# Altium schematic sheet Arria10_Power.SchDoc: Arria 10 Power Inputs
size B; DocumentNumber: 30; SheetNumber: 30; SheetTotal: 46
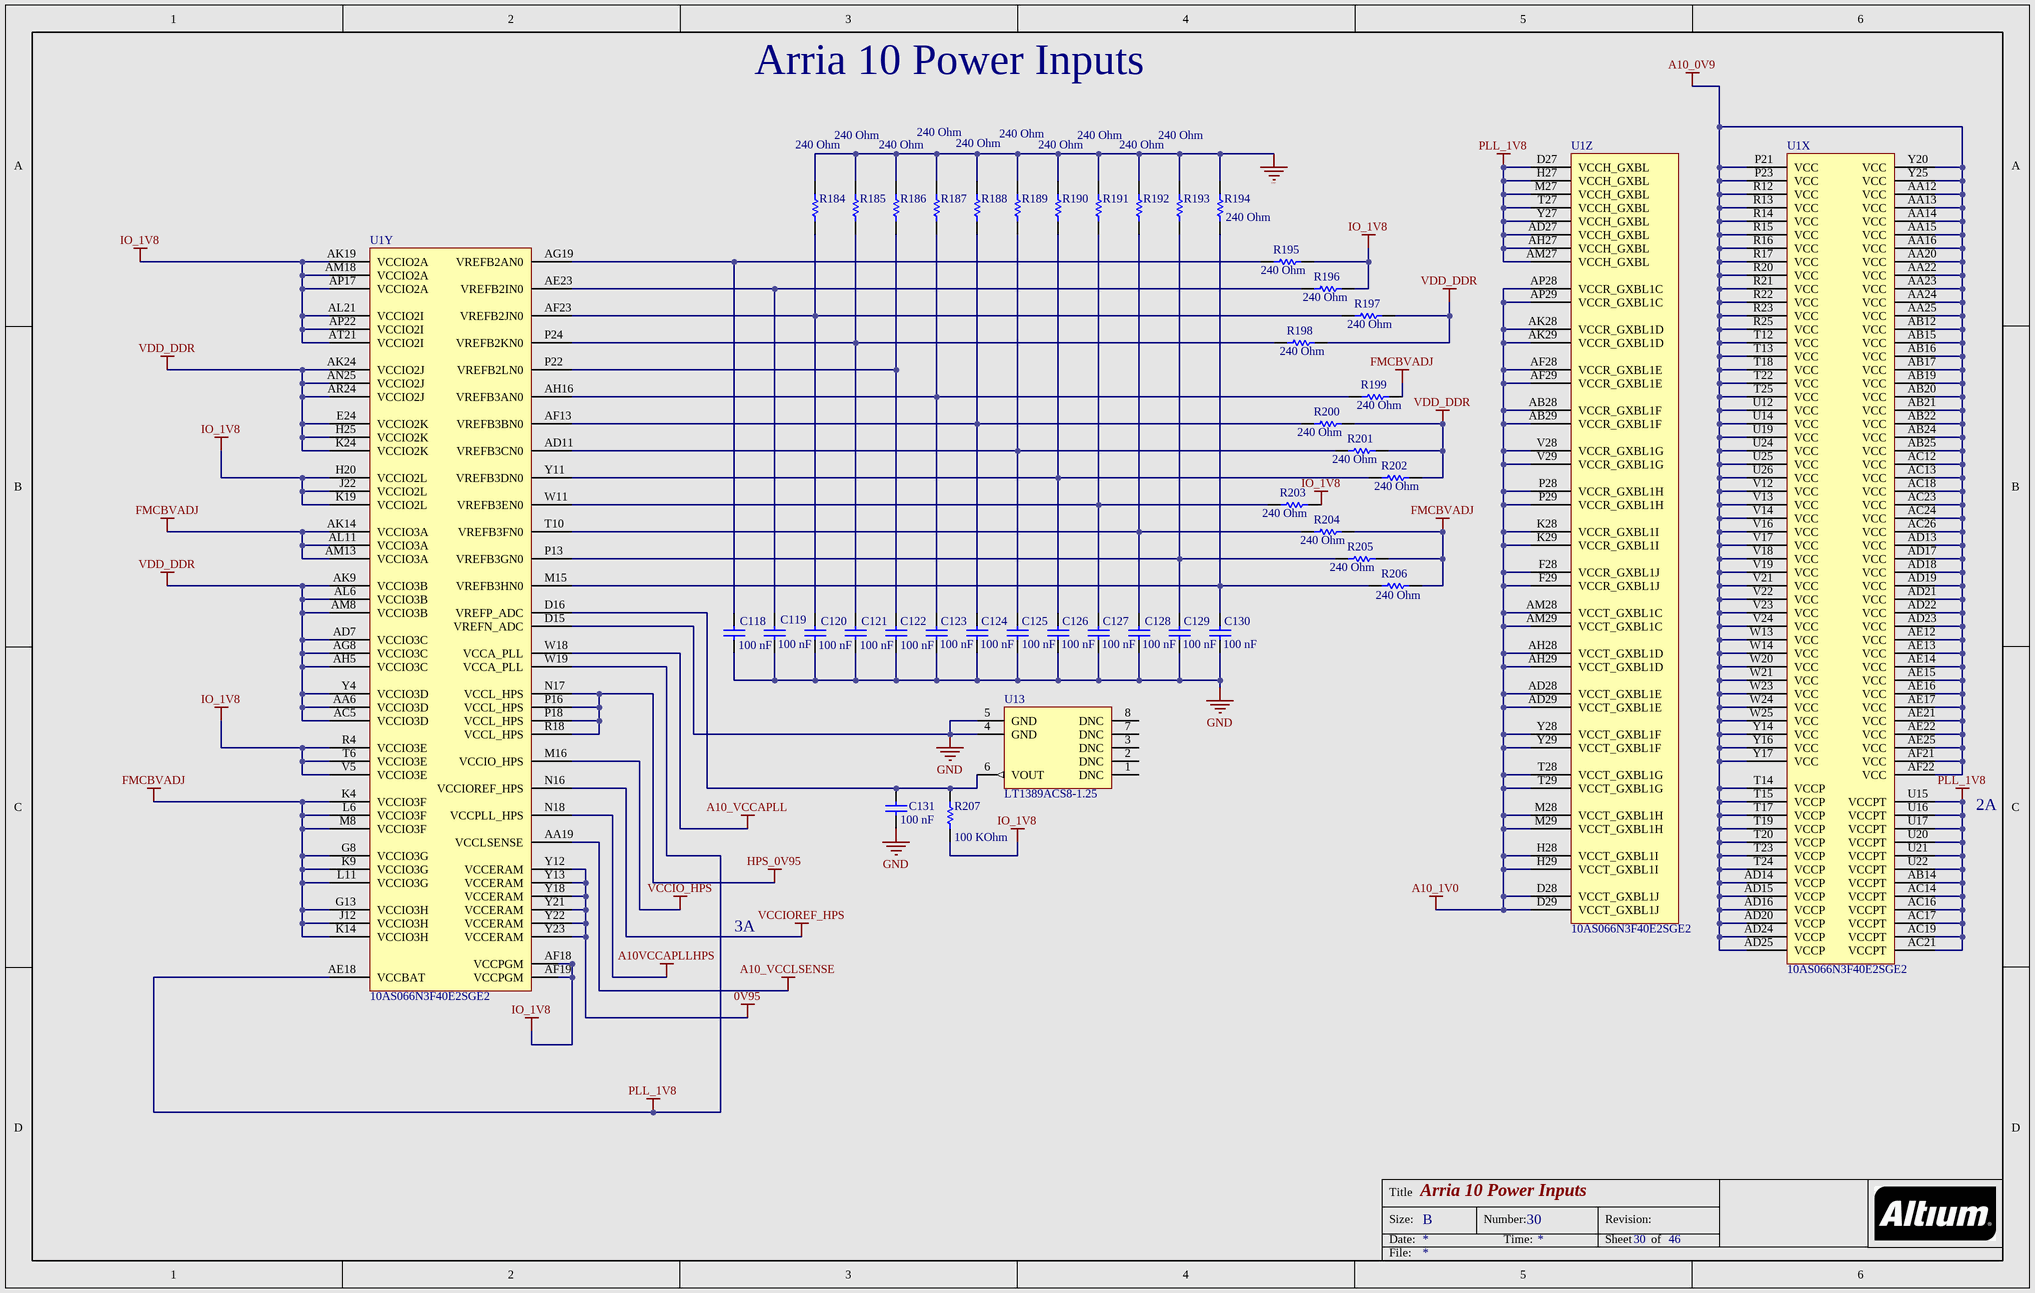
[diagram p0: Arria10_Power.SchDoc]

## Parts
C118  Capacitance: 100 nF  [CAPC0603X33X15LL03T05]  (hidden comment: GRM033R60J104KE19D)
C119  Capacitance: 100 nF  [CAPC0603X33X15LL03T05]  (hidden comment: GRM033R60J104KE19D)
C120  Capacitance: 100 nF  [CAPC0603X33X15LL03T05]  (hidden comment: GRM033R60J104KE19D)
C121  Capacitance: 100 nF  [CAPC0603X33X15LL03T05]  (hidden comment: GRM033R60J104KE19D)
C122  Capacitance: 100 nF  [CAPC0603X33X15LL03T05]  (hidden comment: GRM033R60J104KE19D)
C123  Capacitance: 100 nF  [CAPC0603X33X15LL03T05]  (hidden comment: GRM033R60J104KE19D)
C124  Capacitance: 100 nF  [CAPC0603X33X15LL03T05]  (hidden comment: GRM033R60J104KE19D)
C125  Capacitance: 100 nF  [CAPC0603X33X15LL03T05]  (hidden comment: GRM033R60J104KE19D)
C126  Capacitance: 100 nF  [CAPC0603X33X15LL03T05]  (hidden comment: GRM033R60J104KE19D)
C127  Capacitance: 100 nF  [CAPC0603X33X15LL03T05]  (hidden comment: GRM033R60J104KE19D)
C128  Capacitance: 100 nF  [CAPC0603X33X15LL03T05]  (hidden comment: GRM033R60J104KE19D)
C129  Capacitance: 100 nF  [CAPC0603X33X15LL03T05]  (hidden comment: GRM033R60J104KE19D)
C130  Capacitance: 100 nF  [CAPC0603X33X15LL03T05]  (hidden comment: GRM033R60J104KE19D)
C131  Capacitance: 100 nF  [CAPC1005X55X10LL05]  (hidden comment: C1005X7R1E104M)
R184  Resistance: 240 Ohm  [RESC1005X40X25ML05T05]  (hidden comment: ERJ-2GEJ241x)
R185  Resistance: 240 Ohm  [RESC1005X40X25ML05T05]  (hidden comment: ERJ-2GEJ241x)
R186  Resistance: 240 Ohm  [RESC1005X40X25ML05T05]  (hidden comment: ERJ-2GEJ241x)
R187  Resistance: 240 Ohm  [RESC1005X40X25ML05T05]  (hidden comment: ERJ-2GEJ241x)
R188  Resistance: 240 Ohm  [RESC1005X40X25ML05T05]  (hidden comment: ERJ-2GEJ241x)
R189  Resistance: 240 Ohm  [RESC1005X40X25ML05T05]  (hidden comment: ERJ-2GEJ241x)
R190  Resistance: 240 Ohm  [RESC1005X40X25ML05T05]  (hidden comment: ERJ-2GEJ241x)
R191  Resistance: 240 Ohm  [RESC1005X40X25ML05T05]  (hidden comment: ERJ-2GEJ241x)
R192  Resistance: 240 Ohm  [RESC1005X40X25ML05T05]  (hidden comment: ERJ-2GEJ241x)
R193  Resistance: 240 Ohm  [RESC1005X40X25ML05T05]  (hidden comment: ERJ-2GEJ241x)
R194  Resistance: 240 Ohm  [RESC1005X40X25ML05T05]  (hidden comment: ERJ-2GEJ241x)
R195  Resistance: 240 Ohm  [RESC1005X40X25ML05T05]  (hidden comment: ERJ-2GEJ241x)
R196  Resistance: 240 Ohm  [RESC1005X40X25ML05T05]  (hidden comment: ERJ-2GEJ241x)
R197  Resistance: 240 Ohm  [RESC1005X40X25ML05T05]  (hidden comment: ERJ-2GEJ241x)
R198  Resistance: 240 Ohm  [RESC1005X40X25ML05T05]  (hidden comment: ERJ-2GEJ241x)
R199  Resistance: 240 Ohm  [RESC1005X40X25ML05T05]  (hidden comment: ERJ-2GEJ241x)
R200  Resistance: 240 Ohm  [RESC1005X40X25ML05T05]  (hidden comment: ERJ-2GEJ241x)
R201  Resistance: 240 Ohm  [RESC1005X40X25ML05T05]  (hidden comment: ERJ-2GEJ241x)
R202  Resistance: 240 Ohm  [RESC1005X40X25ML05T05]  (hidden comment: ERJ-2GEJ241x)
R203  Resistance: 240 Ohm  [RESC1005X40X25ML05T05]  (hidden comment: ERJ-2GEJ241x)
R204  Resistance: 240 Ohm  [RESC1005X40X25ML05T05]  (hidden comment: ERJ-2GEJ241x)
R205  Resistance: 240 Ohm  [RESC1005X40X25ML05T05]  (hidden comment: ERJ-2GEJ241x)
R206  Resistance: 240 Ohm  [RESC1005X40X25ML05T05]  (hidden comment: ERJ-2GEJ241x)
R207  Resistance: 100 KOhm  [RESC1005X40X25LL05T05]  (hidden comment: ERJ-2RKF1003X)
U1  10AS066N3F40E2SGE2  [ALTR-FBGA1517_A-350]  (parts X,Y,Z of 31)
U13  LT1389ACS8-1.25  [LT-S8-8_M]

## Nets
0V95: U1.Y12(VCCERAM) U1.Y13(VCCERAM) U1.Y18(VCCERAM) U1.Y21(VCCERAM) U1.Y22(VCCERAM) U1.Y23(VCCERAM)
A10_0V9: U1.AA12(VCC) U1.AA13(VCC) U1.AA14(VCC) U1.AA15(VCC) U1.AA16(VCC) U1.AA20(VCC) U1.AA22(VCC) U1.AA23(VCC) U1.AA24(VCC) U1.AA25(VCC) U1.AB12(VCC) U1.AB15(VCC) U1.AB16(VCC) U1.AB17(VCC) U1.AB19(VCC) U1.AB20(VCC) U1.AB21(VCC) U1.AB22(VCC) U1.AB24(VCC) U1.AB25(VCC) U1.AC12(VCC) U1.AC13(VCC) U1.AC18(VCC) U1.AC23(VCC) U1.AC24(VCC) U1.AC26(VCC) U1.AD13(VCC) U1.AD14(VCCP) U1.AD15(VCCP) U1.AD16(VCCP) U1.AD17(VCC) U1.AD18(VCC) U1.AD19(VCC) U1.AD20(VCCP) U1.AD21(VCC) U1.AD22(VCC) U1.AD23(VCC) U1.AD24(VCCP) U1.AD25(VCCP) U1.AE12(VCC) U1.AE13(VCC) U1.AE14(VCC) U1.AE15(VCC) U1.AE16(VCC) U1.AE17(VCC) U1.AE21(VCC) U1.AE22(VCC) U1.AE25(VCC) U1.AF21(VCC) U1.AF22(VCC) U1.P21(VCC) U1.P23(VCC) U1.R12(VCC) U1.R13(VCC) U1.R14(VCC) U1.R15(VCC) U1.R16(VCC) U1.R17(VCC) U1.R20(VCC) U1.R21(VCC) U1.R22(VCC) U1.R23(VCC) U1.R25(VCC) U1.T12(VCC) U1.T13(VCC) U1.T14(VCCP) U1.T15(VCCP) U1.T17(VCCP) U1.T18(VCC) U1.T19(VCCP) U1.T20(VCCP) U1.T22(VCC) U1.T23(VCCP) U1.T24(VCCP) U1.T25(VCC) U1.U12(VCC) U1.U14(VCC) U1.U19(VCC) U1.U24(VCC) U1.U25(VCC) U1.U26(VCC) U1.V12(VCC) U1.V13(VCC) U1.V14(VCC) U1.V16(VCC) U1.V17(VCC) U1.V18(VCC) U1.V19(VCC) U1.V21(VCC) U1.V22(VCC) U1.V23(VCC) U1.V24(VCC) U1.W13(VCC) U1.W14(VCC) U1.W20(VCC) U1.W21(VCC) U1.W23(VCC) U1.W24(VCC) U1.W25(VCC) U1.Y14(VCC) U1.Y16(VCC) U1.Y17(VCC) U1.Y20(VCC) U1.Y25(VCC)
A10_1V0: U1.AB28(VCCR_GXBL1F) U1.AB29(VCCR_GXBL1F) U1.AD28(VCCT_GXBL1E) U1.AD29(VCCT_GXBL1E) U1.AF28(VCCR_GXBL1E) U1.AF29(VCCR_GXBL1E) U1.AH28(VCCT_GXBL1D) U1.AH29(VCCT_GXBL1D) U1.AK28(VCCR_GXBL1D) U1.AK29(VCCR_GXBL1D) U1.AM28(VCCT_GXBL1C) U1.AM29(VCCT_GXBL1C) U1.AP28(VCCR_GXBL1C) U1.AP29(VCCR_GXBL1C) U1.D28(VCCT_GXBL1J) U1.D29(VCCT_GXBL1J) U1.F28(VCCR_GXBL1J) U1.F29(VCCR_GXBL1J) U1.H28(VCCT_GXBL1I) U1.H29(VCCT_GXBL1I) U1.K28(VCCR_GXBL1I) U1.K29(VCCR_GXBL1I) U1.M28(VCCT_GXBL1H) U1.M29(VCCT_GXBL1H) U1.P28(VCCR_GXBL1H) U1.P29(VCCR_GXBL1H) U1.T28(VCCT_GXBL1G) U1.T29(VCCT_GXBL1G) U1.V28(VCCR_GXBL1G) U1.V29(VCCR_GXBL1G) U1.Y28(VCCT_GXBL1F) U1.Y29(VCCT_GXBL1F)
A10_VCCAPLL: U1.W18(VCCA_PLL)
A10_VCCLSENSE: U1.AA19(VCCLSENSE)
A10VCCAPLLHPS: U1.N18(VCCPLL_HPS)
FMCBVADJ: R199.1 R204.1 R205.1 R206.1 U1.AK14(VCCIO3A) U1.AL11(VCCIO3A) U1.AM13(VCCIO3A) U1.G8(VCCIO3G) U1.G13(VCCIO3H) U1.J12(VCCIO3H) U1.K4(VCCIO3F) U1.K9(VCCIO3G) U1.K14(VCCIO3H) U1.L6(VCCIO3F) U1.L11(VCCIO3G) U1.M8(VCCIO3F)
GND: C118.1 C119.1 C120.1 C121.1 C122.1 C123.1 C124.1 C125.1 C126.1 C127.1 C128.1 C129.1 C130.1 C131.1 R184.2 R185.2 R186.2 R187.2 R188.2 R189.2 R190.2 R191.2 R192.2 R193.2 R194.1 U1.D15(VREFN_ADC) U13.4(GND) U13.5(GND)
HPS_0V95: U1.N17(VCCL_HPS) U1.P16(VCCL_HPS) U1.P18(VCCL_HPS) U1.R18(VCCL_HPS)
IO_1V8: R195.1 R196.1 R203.1 R207.1 U1.AF18(VCCPGM) U1.AF19(VCCPGM) U1.AK19(VCCIO2A) U1.AL21(VCCIO2I) U1.AM18(VCCIO2A) U1.AP17(VCCIO2A) U1.AP22(VCCIO2I) U1.AT21(VCCIO2I) U1.H20(VCCIO2L) U1.J22(VCCIO2L) U1.K19(VCCIO2L) U1.R4(VCCIO3E) U1.T6(VCCIO3E) U1.V5(VCCIO3E)
PLL_1V8: U1.AB14(VCCPT) U1.AC14(VCCPT) U1.AC16(VCCPT) U1.AC17(VCCPT) U1.AC19(VCCPT) U1.AC21(VCCPT) U1.AD27(VCCH_GXBL) U1.AE18(VCCBAT) U1.AH27(VCCH_GXBL) U1.AM27(VCCH_GXBL) U1.D27(VCCH_GXBL) U1.H27(VCCH_GXBL) U1.M27(VCCH_GXBL) U1.T27(VCCH_GXBL) U1.U15(VCCPT) U1.U16(VCCPT) U1.U17(VCCPT) U1.U20(VCCPT) U1.U21(VCCPT) U1.U22(VCCPT) U1.W19(VCCA_PLL) U1.Y27(VCCH_GXBL)
VCCIO_HPS: U1.M16(VCCIO_HPS)
VCCIOREF_HPS: U1.N16(VCCIOREF_HPS)
VDD_DDR: R197.1 R198.1 R200.1 R201.1 R202.1 U1.AA6(VCCIO3D) U1.AC5(VCCIO3D) U1.AD7(VCCIO3C) U1.AG8(VCCIO3C) U1.AH5(VCCIO3C) U1.AK9(VCCIO3B) U1.AK24(VCCIO2J) U1.AL6(VCCIO3B) U1.AM8(VCCIO3B) U1.AN25(VCCIO2J) U1.AR24(VCCIO2J) U1.E24(VCCIO2K) U1.H25(VCCIO2K) U1.K24(VCCIO2K) U1.Y4(VCCIO3D)
NetC118_2: C118.2 R195.2 U1.AG19(VREFB2AN0)
NetC119_2: C119.2 R196.2 U1.AE23(VREFB2IN0)
NetC120_2: C120.2 R184.1 R197.2 U1.AF23(VREFB2JN0)
NetC121_2: C121.2 R185.1 R198.2 U1.P24(VREFB2KN0)
NetC122_2: C122.2 R186.1 U1.P22(VREFB2LN0)
NetC123_2: C123.2 R187.1 R199.2 U1.AH16(VREFB3AN0)
NetC124_2: C124.2 R188.1 R200.2 U1.AF13(VREFB3BN0)
NetC125_2: C125.2 R189.1 R201.2 U1.AD11(VREFB3CN0)
NetC126_2: C126.2 R190.1 R202.2 U1.Y11(VREFB3DN0)
NetC127_2: C127.2 R191.1 R203.2 U1.W11(VREFB3EN0)
NetC128_2: C128.2 R192.1 R204.2 U1.T10(VREFB3FN0)
NetC129_2: C129.2 R193.1 R205.2 U1.P13(VREFB3GN0)
NetC130_2: C130.2 R194.2 R206.2 U1.M15(VREFB3HN0)
NetC131_2: C131.2 R207.2 U1.D16(VREFP_ADC) U13.6(VOUT)

Not connected (* = marked no-connect by the designer): U13 1(DNC) 2(DNC) 3(DNC) 7(DNC) 8(DNC)

## Notes on the sheet
- 2A
- 3A
- Title
- Size:
- Date:
- B
- Number:
- Time:
- Revision:
- Sheet
- of
- File:

## Library data of the parts
C118-C130 = CMP-2010-01652-4: Chip Capacitor, 100 nF, +/- 10%, 6.3 V, -55 to 85 degC, 0201 (0603 Metric), RoHS, Tape and Reel; Manufacturer: Basic Passives; Voltage Rating: 6.3 V; Type (Capacitors): X5R; Voltage Rating (DC): 3 V; Case\/Package: 0201; Tolerance: 10%; Min Operating Temperature: -55 degC; PartNumber: GRM033R60J104KE19D; Mounting Technology: Surface Mount; RoHSCompliant: true; Max Operating Temperature: 85 degC; Package Quantity: 15000; Packaging: Tape and Reel; Case Code (Imperial): 0201; Width: 0.3 mm; ComponentLink1URL: http://www.murata.com/; Case Code (Metric): 0603; ComponentLink1Description: Manufacturer URL; REACH SVHC: No SVHC; Height: 0.3 mm; Length: 0.6 mm; PackageDescription: 2-Pin Surface Mount Device, Body 0.6 x 0.3 mm; ComponentLink2Description: Datasheet; Pins: 2; PackageReference: 0201; Mount: Surface Mount; ComponentLink2URL: http://search.murata.co.jp/Ceramy/image/img/A01X/G101/ENG/GRM033R60J104KE19-01.pdf; DatasheetVersion: 03/2016; Radiation Hardening: No
C131 = CMP-1663-00009-2: Chip Capacitor, 0.1 uF, +/- 20%, 25 V, -55 to 125 degC, 0402 (1005 Metric), RoHS, Tape and Reel; Type (Capacitors): X7R; Voltage Rating: 25 V; Case\/Package: 0402; Tolerance: 20%; Mounting Technology: Surface Mount; Max Operating Temperature: 125 degC; ComponentLink2URL: http://www.farnell.com/datasheets/1571323.pdf; ComponentLink1URL: http://www.tdk.com/; RoHSCompliant: true; Packaging: Tape and Reel; ComponentLink2Description: Datasheet; Case Code (Imperial): 0402; DatasheetVersion: 09/2011; ComponentLink1Description: Manufacturer URL; PackageDescription: 2-Pin Surface Mount Device, Body 1 x 0.5 mm; PackageReference: 0402; Min Operating Temperature: -55 degC; Case Code (Metric): 1005; Height: 0.5 mm; Package Quantity: 10000; Width: 0.5 mm; Pins: 2; Voltage Rating (DC): 25 V; PartNumber: C1005X7R1E104M; Mount: Surface Mount; Length: 1 mm
R184-R206 = CMP-2002-00493-3: Chip Resistor, 240 Ohm, +/- 5%, 100 mW, -55 to 155 degC, 0402 (1005 Metric), RoHS, Tape and Reel; Manufacturer: Basic Passives; Power Rating: 100 mW; Voltage Rating: 50 V; Case\/Package: 0402; Tolerance: 5%; Height: 0.35 mm; Case Code (Imperial): 0402; Width: 0.5 mm; Case Code (Metric): 1005; Min Operating Temperature: -55 degC; Package Quantity: 10000; PartNumber: ERJ-2GEJ241x; ComponentLink1Description: Manufacturer URL; REACH SVHC: Yes; Length: 1 mm; Mount: Surface Mount; ComponentLink1URL: http://www.panasonic.com/; Packaging: Tape and Reel; PackageDescription: 2-Pin Surface Mount Device, Body 1 x 0.5 mm; RoHSCompliant: true; Max Operating Temperature: 155 degC; Mounting Technology: Surface Mount; PackageReference: 0402; ComponentLink2Description: Datasheet; Radiation Hardening: No; DatasheetVersion: 03/2015; Pins: 2; ComponentLink2URL: http://industrial.panasonic.com/cdbs/www-data/pdf/RDA0000/AOA0000C84.pdf
R207 = CMP-2002-00608-3: Chip Resistor, 100 KOhm, +/- 1%, 100 mW, -55 to 155 degC, 0402 (1005 Metric), RoHS, Tape and Reel; Manufacturer: Basic Passives; Voltage Rating: 50 V; Power Rating: 100 mW; Case\/Package: 0402; Tolerance: 1%; Height: 0.35 mm; ComponentLink1Description: Manufacturer URL; Packaging: Tape and Reel; Min Operating Temperature: -55 degC; RoHSCompliant: true; PackageDescription: 2-Pin Surface Mount Device, Body 1 x 0.5 mm; Mount: Surface Mount; Package Quantity: 10000; Max Operating Temperature: 155 degC; ComponentLink1URL: http://www.panasonic.com/; Mounting Technology: Surface Mount; PartNumber: ERJ-2RKF1003X; Case Code (Metric): 1005; Case Code (Imperial): 0402; REACH SVHC: Yes; Length: 1 mm; Width: 0.5 mm; DatasheetVersion: 04/2015; Pins: 2; ComponentLink2Description: Datasheet; ComponentLink2URL: http://industrial.panasonic.com/cdbs/www-data/pdf/RDA0000/AOA0000C86.pdf; PackageReference: 0402; Radiation Hardening: No
U1 = CMP-1689-00006-3: Arria 10 SX Family, 588 I/O Pins, 16 Fractional PLLs, 1517-Pin FBGA, Speed Grade 2, Extended Grade, RoHS; ComponentLink3Description: Package Specification; PackageVersion: Rev. 5.0, 01/2016; ComponentLink3URL: https://www.altera.com/content/dam/altera-www/global/en_US/pdfs/literature/packaging/04r00461-04.pdf; ComponentLink2Description: Datasheet; Code_JEDEC: MS-034; Mounting Technology: Surface Mount; PartNumber: 10AS066N3F40E2SGE2; PackageDescription: 1517-Pin FineLine Ball-Grid Array (FBGA), Body 40 x 40 mm, Pitch 1 mm; ComponentLink2URL: https://www.altera.com/content/dam/altera-www/global/en_US/pdfs/literature/hb/arria-10/a10_datasheet.pdf; ComponentLink1URL: https://www.altera.com/; DatasheetVersion: Rev. 2016-06-24, 06/2016; ComponentLink1Description: Manufacturer URL
U13 = CMP-1701-00004-2: Nanopower Precision Shunt Voltage Reference, 1.25 V, 0.05%, 10 ppm/degC, 0 to 70 degC, 8-Pin S8, Tube; Current - Cathode: 600µA; Output Type: Fixed; Current - Output: 20mA; Noise - 0.1Hz to 10Hz: 25µVp-p; Voltage - Output (Min/Fixed): 1.25V; Product Training Modules: Voltage Reference Basics; Temperature Coefficient: 10ppm/°C; ComponentLink2URL: http://cds.linear.com/docs/en/datasheet/1389fa.pdf; Tolerance: ±0.05%; Series: -; Family: PMIC - Voltage Reference; Mounting Type: Surface Mount; ComponentLink1Description: Manufacturer URL; Noise - 10Hz to 10kHz: -; Category: Integrated Circuits (ICs); Operating Temperature: 0°C ~ 70°C (TA); Current - Supply: -; Standard Package: 100; DatasheetVersion: Rev. A; Reference Type: Shunt; Voltage - Input: -; Package / Case: 8-SOIC (0.154&quot;, 3.90mm Width); Mounting Technology: Surface Mount; ComponentLink1URL: http://www.linear.com/; ComponentLink2Description: Datasheet; Packaging: Tube; PackageDescription: 8-Pin Small Outline Integrated Package, Body 5 x 4 mm, Pitch 1.27 mm; Voltage - Output (Max): -; PartNumber: LT1389ACS8-1.25